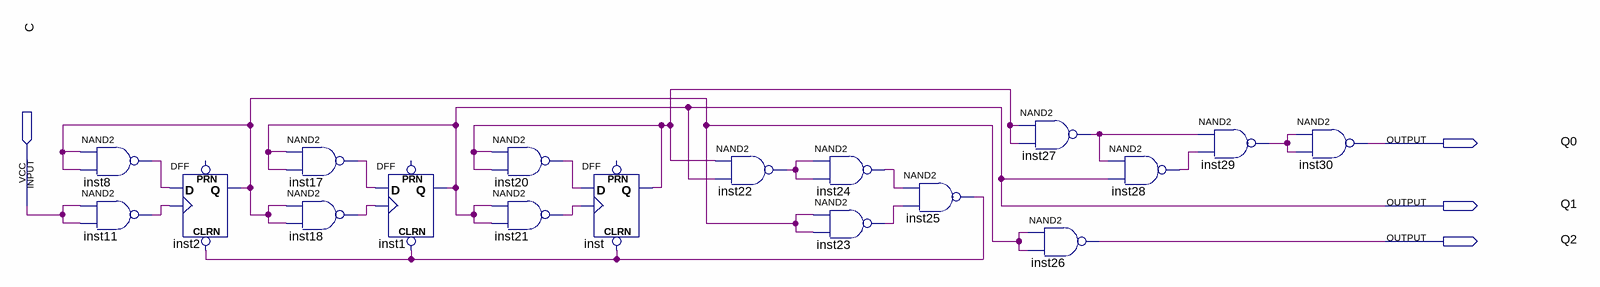
[diagram p0: schematic sheet]
// Quartus schematic CNT.bdf as structural Verilog: 18 symbols, 4 pins
module CNT (
  input  C,
  output Q0,
  output Q1,
  output Q2
);

  wire inst2_q, inst8_out, inst11_out, inst17_out, inst18_out, inst20_out, inst21_out, inst22_out,
       inst23_out, inst24_out, inst25_out, inst27_out, inst28_out, inst29_out, inst_q;

  nand inst8 (inst8_out, inst2_q, inst2_q);
  nand inst11 (inst11_out, C, C);
  DFF inst2 (.CLRN(inst25_out), .CLK(inst11_out), .D(inst8_out), .Q(inst2_q));  // open: PRN
  nand inst17 (inst17_out, Q1, Q1);
  nand inst18 (inst18_out, inst2_q, inst2_q);
  DFF inst1 (.CLRN(inst25_out), .CLK(inst18_out), .D(inst17_out), .Q(Q1));  // open: PRN
  nand inst20 (inst20_out, inst_q, inst_q);
  nand inst21 (inst21_out, Q1, Q1);
  DFF inst (.CLRN(inst25_out), .CLK(inst21_out), .D(inst20_out), .Q(inst_q));  // open: PRN
  nand inst22 (inst22_out, inst_q, Q1);
  nand inst24 (inst24_out, inst22_out, inst22_out);
  nand inst23 (inst23_out, inst2_q, inst2_q);
  nand inst25 (inst25_out, inst24_out, inst23_out);
  nand inst27 (inst27_out, inst_q, inst_q);
  nand inst26 (Q2, inst2_q, inst2_q);
  nand inst28 (inst28_out, inst27_out, Q1);
  nand inst29 (inst29_out, inst27_out, inst28_out);
  nand inst30 (Q0, inst29_out, inst29_out);
endmodule
